# Altium schematic sheet Power.SchDoc
size A4; SheetNumber: 6; SheetTotal: 8
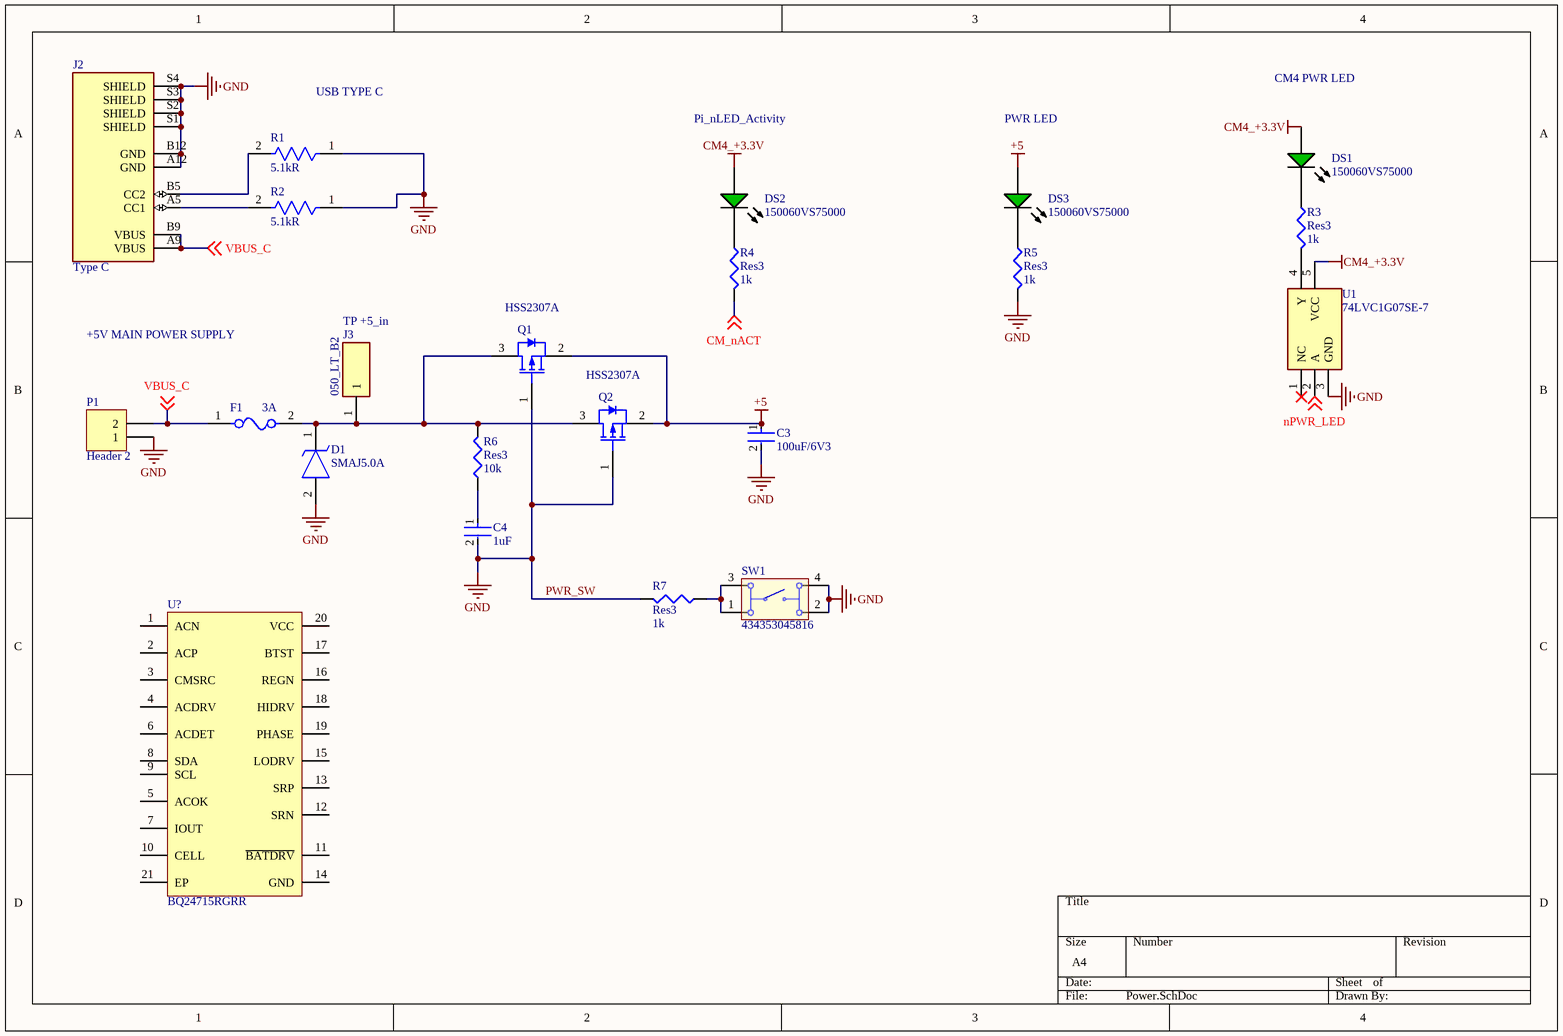
[diagram p0: Power.SchDoc]

## Parts
C3  100uF/6V3  [FP-CC0603-DA-MFG]
C4  1uF  [FP-CC0603-DA-MFG]
D1  SMAJ5.0A  [DIOM5026X229N]
DS1  150060VS75000  [WE-150060VS75000_V]
DS2  150060VS75000  [WE-150060VS75000_V]
DS3  150060VS75000  [WE-150060VS75000_V]
F1  3A  [FP-0466-MFG]
J2  Type C  [GCT_USB4125-GF-A_REVA2]
J3  050_LT_B2  [050LTB2]
P1  Header 2  [HDR1X2]
Q1  HSS2307A  [NXP-SOT23_M]
Q2  HSS2307A  [NXP-SOT23_M]
R1  Resistance: 5.1kR  [FP-CRCW0603-e3-IPC_C]  (hidden comment: CRCW06035K10FKEA)
R2  Resistance: 5.1kR  [FP-CRCW0603-e3-IPC_C]  (hidden comment: CRCW06035K10FKEA)
R3  Res3  value 1k  [J1-0603]
R4  Res3  value 1k  [J1-0603]
R5  Res3  value 1k  [J1-0603]
R6  Res3  value 10k  [J1-0603]
R7  Res3  value 1k  [J1-0603]
SW1  434353045816  [434353045816]
U1  74LVC1G07SE-7  [SOT65P210X110-5N]
U?  BQ24715RGRR  [QFN50P350X350X100-21N-D]

## Nets
+5: C3.1 DS3.2(A) Q1.2(S) Q2.2(S)
CM4_+3.3V: DS1.2(A) DS2.2(A) U1.5(VCC)
PWR_SW: C3.2 C4.2 D1.2(A) J2.A12(GND) J2.B12(GND) J2.S1(SHIELD) J2.S2(SHIELD) J2.S3(SHIELD) J2.S4(SHIELD) P1.1 Q1.1(G) Q2.1(G) R1.1 R2.1 R5.2 R7.2 SW1.2 SW1.4 U1.3(GND)  [also labelled GND]
CM_nACT: R4.2 ; off-sheet CM_nACT
nPWR_LED: U1.2(A) ; off-sheet nPWR_LED
VBUS_C: F1.1 J2.A9(VBUS) J2.B9(VBUS) P1.2 ; off-sheet VBUS_C
NetC4_1: C4.1 R6.1
NetD1_1: D1.1(K) F1.2 J3.1 Q1.3(D) Q2.3(D) R6.2
NetDS1_1: DS1.1(K) R3.1
NetDS2_1: DS2.1(K) R4.1
NetDS3_1: DS3.1(K) R5.1
NetJ2_A5: J2.A5(CC1) R2.2
NetJ2_B5: J2.B5(CC2) R1.2
NetR3_2: R3.2 U1.4(Y)
NetR7_1: R7.1 SW1.1 SW1.3

Not connected (* = marked no-connect by the designer): U1 1(NC)*; U? 1(ACN) 2(ACP) 3(CMSRC) 4(ACDRV) 5(ACOK) 6(ACDET) 7(IOUT) 8(SDA) 9(SCL) 10(CELL) 11(~{BATDRV}) 12(SRN) 13(SRP) 14(GND) 15(LODRV) 16(REGN) 17(BTST) 18(HIDRV) 19(PHASE) 20(VCC) 21(EP)

## Notes on the sheet
- USB TYPE C
- CM4 PWR LED
- Pi_nLED_Activity
- PWR LED
- +5V MAIN POWER SUPPLY
- TP +5_in

## Library data of the parts
C3 C4 = CMP-03422-000924-1: CAP CER 1UF 16V X7R 0603; Manufacturer: YAGEO; Manufacturer Part Number: CC0603KRX7R7BB105; Tolerance: 0.1; Temperature Coefficient: 15%; Material: Ceramic; Package: CC0603-DA; RoHS: TRUE; Device Class L2: Capacitors; Temperature Characteristic: X7R; Temperature: -55°C to +125°C; Temperature Range Low: -55°C; Automotive: No; ComponentLink2Description: Datasheet; Value: 1 uF; Lead Free: Yes; Capacitance: 1 uF; ComponentLink2URL: http://www.yageo.com/documents/recent/UPY-GPHC_X7R_6.3V-to-50V_18.pdf; Device Class L1: Passive Components; Voltage: 16 V; Octopart: https://octopart.com/cc0603krx7r7bb105-yageo-42271928; Category: Cap; Digikey Description: CAP CER 1UF 16V X7R 0603; Footprint Url: http://www.yageo.com/exep/pages/download/literatures/UPY-C_GEN_24.pdf; Height: 0.9mm; Voltage Rating: 16 V; Temperature Range High: +125°C; Mouser Description: Multilayer Ceramic Capacitor, CC Series, 1 - F, - 10%, X7R, 16 V, 0603 [1608 Metric]; Device Class L3: Ceramic Capacitors
D1 = SMAJ5.0A: TVS Diode (Uni-directional); Manufacturer_Name: LITTELFUSE; Datasheet Link: https://www.littelfuse.com/~/media/electronics/datasheets/tvs_diodes/littelfuse_tvs_diode_smaj_datasheet.pdf.pdf; Height: 2.29mm; Manufacturer_Part_Number: SMAJ5.0A; Mouser Part Number: 576-SMAJ5.0A; Mouser Price/Stock: https://www.mouser.co.uk/ProductDetail/Littelfuse/SMAJ50A?qs=2VFNtWizgicfetZVA4gWHA%3D%3D; Arrow Part Number: SMAJ5.0A; Arrow Price/Stock: https://www.arrow.com/en/products/smaj5.0a/littelfuse
DS1-DS3 = CMP-1426-00006-4: WL-SMCW SMD Chip LED Top View Monocolor Waterclear, 30 mA, 2 V, -40 to 85 degC, 2-Pin SMD, RoHS, Tape and Reel; DatasheetVersion: Rev. 2.7; PackageDescription: 2-Pin Surface Mount Device, Body 1.6 x 0.8 mm; ComponentLink1URL: https://www.we-online.com/; PartNumber: 150060VS75000; RoHSCompliant: True; ComponentLink2URL: http://katalog.we-online.de/led/datasheet/150060VS75000.pdf; ComponentLink1Description: Manufacturer URL; Mounting Technology: Surface Mount; ComponentLink2Description: Datasheet
F1 = CMP-08605-000054-1: FUSE BOARD MNT 3A 32VAC/VDC 1206; Manufacturer Part Number: 0466003.NR; Manufacturer: Littelfuse; Fuse Interrupt Ac Current: 50A; Fuse Voltage Drop: 75.99mV; Max Fuse Ac Voltage: 32V; Fuse I2T: 0.576A2Sec; Resistance: 0.019Ω; Fuse Blow Speed: Fast; Value: 0.019Ω; ComponentLink2Description: Datasheet; Fuse Current: 3A; RoHS: TRUE; Mouser Description: Surface Mount Fuses 32V 3A VFA Slimline; Height: 0.66mm; Octopart: https://octopart.com/0466003.nr-littelfuse-565175; Package: 0466; Fuse Interrupt Dc Current: 50A; Temperature Range Low: -55°C; ComponentLink2URL: https://www.littelfuse.com/~/media/electronics/datasheets/fuses/littelfuse_fuse_466_datasheet.pdf.pdf; Digikey Description: FUSE BOARD MNT 3A 32VAC/VDC 1206; Voltage Rating: 32V; Category: Fuse; Lead Free: Yes; Device Class L2: Fuses; Automotive: No; Max Fuse Dc Voltage: 32V; Temperature Range High: +90°C; Device Class L3: unset; Device Class L1: Circuit Protection; Temperature: -55°C to +90°C
J2 = USB4125-GF-A_REVA2: USB Charge Only Connector Type C Horizontal Receptacle, 3.16mm profile, 6 Pins, Surface mount, Top mount, low cost; MF: Global Connector Technology; Check_prices: https://www.snapeda.com/parts/USB4125-GF-A/Global%20Connector%20Technology/view-part/5160675/?ref=eda; Package: None; MP: USB4125-GF-A; Value: *; Availability: In Stock; SnapEDA_Link: https://www.snapeda.com/parts/USB4125-GF-A/Global%20Connector%20Technology/view-part/5160675/?ref=snap; Price: None
J3 = 050_LT_B2: Connector; Manufacturer_Name: Oxley; Manufacturer_Part_Number: 050/LT/B2; Datasheet Link: http://www.farnell.com/datasheets/2644146.pdf?_ga=2.63921641.795442872.1562935128-2061028581.1560430415; Height: 4.5mm
P1 = Header 2: Header, 2-Pin; LatestRevisionDate: 17-Jul-2002; LatestRevisionNote: Re-released for DXP Platform.; Publisher: Altium Limited
Q1 Q2 = CMP-1258-00153-1: P-Channel Enhancement Mode MOS Transistor, -60 V, -0.3 A, -55 to 150 degC, 3-Pin SOT23, Tape and Reel; PartNumber: BSH201,215; Manufacturer: NXP Semiconductors; Ciss [typ] (pF): 70; Qr [typ] (nC): 58; VGSth [typ] (V): -1.9; Channel Type: P; Coss [typ] (pF): 15; Packing: Tape & Reel; PackageReference: SOT23; Code_JEDEC: TO-236AB; ID [max] (A): -0.3; ComponentLink1URL: http://www.nxp.com/; PackageDescription: 3-Pin Small Outline Transistor Package, Body 2.9 x 1.3 mm, Pitch 0.95 mm; PackageVersion: 06-03-16, 03/2006; DatasheetVersion: Rev. 1.000; ComponentLink2URL: http://www.nxp.com/documents/data_sheet/BSH201.pdf; Mounting Technology: Surface Mount; ComponentLink1Description: Manufacturer URL; ComponentLink2Description: Datasheet; ComponentLink3Description: Package Specification; ComponentLink3URL: http://www.nxp.com/documents/outline_drawing/sot023_po.pdf; VDS [max] (V): -60
R1 R2 = CMP-1012-00590-3: RES Thick Film, 5.1kΩ, 1%, 0.1W, 100ppm/°C, 0603; Power Rating: 100mW; Voltage Rating (DC): 75V; Width: 0.85mm; Depth: 0.85mm; Military Standard: Not; Package Quantity: 5000; Case Code (Metric): 1608; Length: 1.55mm; Weight: 7.1E-05oz; Packaging: Tape and Reel; Temperature Coefficient: 100ppm/°C; Case Code (Imperial): 0603; Lead Free: Lead Free; Radiation Hardening: No; Contact Plating: Tin; Composition: Thick Film; Max Operating Temperature: 155°C; Termination: SMD/SMT; Case/Package: 0603; Min Operating Temperature: -55°C; Tolerance: 1%; Voltage Rating: 75V; Mount: Surface Mount; Height: 0.45mm
R3-R7 = Res3: Resistor; Published: 8-Jun-2000; LatestRevisionDate: 29-May-2009; LatestRevisionNote: IPC-7351 Footprint Added.; PackageReference: J1-0603; Publisher: Altium Limited; PackageDescription: Chip Resistor
SW1 = CMP-1462-00002-1: WS-TASU J-Bend SMD Tact Switch 4.7X3.5 mm side push; Manufacturer: Wuerth Elektronik; NoPins: 04; PartNumber: 434353045816; ComponentLink2Description: Datasheet; ComponentLink1URL: http://www.we-online.com; ComponentLink1Description: Manufacturer URL; ComponentLink2URL: http://katalog.we-online.de/em/datasheet/434353045816.pdf; PackageReference: 434353045816
U1 = 74LVC1G07SE-7: Undefined or Miscellaneous; Manufacturer_Name: Diodes Inc.; Datasheet Link: https://componentsearchengine.com/Datasheets/2/74LVC1G07SE-7.pdf; Height: 1.1mm; Manufacturer_Part_Number: 74LVC1G07SE-7; Mouser Part Number: 621-74LVC1G07SE-7; Mouser Price/Stock: https://www.mouser.co.uk/ProductDetail/Diodes-Incorporated/74LVC1G07SE-7?qs=abZ1nkZpTuNoZmx9wrxFdA%3D%3D; Arrow Part Number: 74LVC1G07SE-7; Arrow Price/Stock: https://www.arrow.com/en/products/74lvc1g07se-7/diodes-incorporated
U? = BQ24715RGRR: Integrated Circuit; Manufacturer_Name: Texas Instruments; Datasheet Link: http://www.ti.com/lit/gpn/bq24715; Height: 1mm; Manufacturer_Part_Number: BQ24715RGRR; Mouser Part Number: 595-BQ24715RGRR; Mouser Price/Stock: https://www.mouser.co.uk/ProductDetail/Texas-Instruments/BQ24715RGRR?qs=biyDIajrTn47XBzYmaZUww%3D%3D; Arrow Part Number: BQ24715RGRR; Arrow Price/Stock: https://www.arrow.com/en/products/bq24715rgrr/texas-instruments